# EAGLE design M103 (EAGLE 6.6.0)
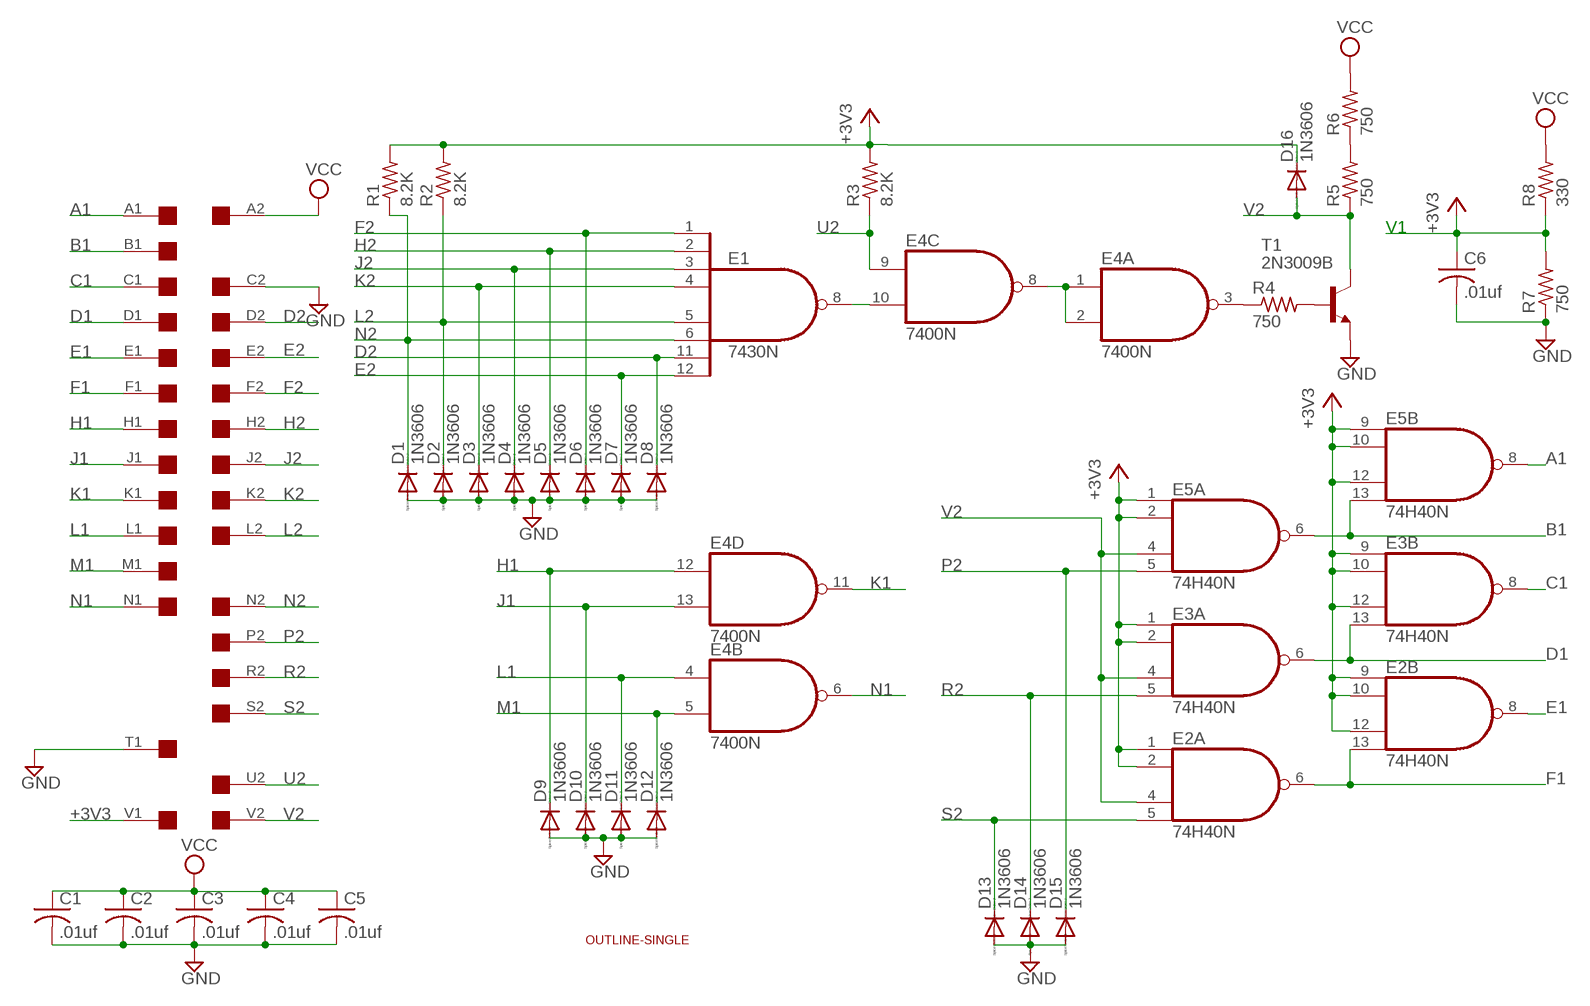
[diagram p0: schematic, sheet 1]

## Parts
C1  .01uf  C-US050-025X075  [C050-025X075]
C2  .01uf  C-US050-025X075  [C050-025X075]
C3  .01uf  C-US050-025X075  [C050-025X075]
C4  .01uf  C-US050-025X075  [C050-025X075]
C5  .01uf  C-US050-025X075  [C050-025X075]
C6  .01uf  C-US050-025X075  [C050-025X075]
D1  1N3606  1N4148DO35-10  [DO35-10]
D2  1N3606  1N4148DO35-10  [DO35-10]
D3  1N3606  1N4148DO35-10  [DO35-10]
D4  1N3606  1N4148DO35-10  [DO35-10]
D5  1N3606  1N4148DO35-10  [DO35-10]
D6  1N3606  1N4148DO35-10  [DO35-10]
D7  1N3606  1N4148DO35-10  [DO35-10]
D8  1N3606  1N4148DO35-10  [DO35-10]
D9  1N3606  1N4148DO35-10  [DO35-10]
D10  1N3606  1N4148DO35-10  [DO35-10]
D11  1N3606  1N4148DO35-10  [DO35-10]
D12  1N3606  1N4148DO35-10  [DO35-10]
D13  1N3606  1N4148DO35-10  [DO35-10]
D14  1N3606  1N4148DO35-10  [DO35-10]
D15  1N3606  1N4148DO35-10  [DO35-10]
D16  1N3606  1N4148DO35-10  [DO35-10]
E1  7430N  [DIL14]
E2  74H40N  74S20N  [DIL14]
E3  74H40N  74S20N  [DIL14]
E4  7400N  [DIL14]
E5  74H40N  74S20N  [DIL14]
R1  8.2K  R-US_0207/10  [0207/10]
R2  8.2K  R-US_0207/10  [0207/10]
R3  8.2K  R-US_0207/10  [0207/10]
R4  750  R-US_0207/10  [0207/10]
R5  750  R-US_0207/10  [0207/10]
R6  750  R-US_0207/10  [0207/10]
R7  750  R-US_0207/10  [0207/10]
R8  330  R-US_0207/10  [0207/10]
T1  2N3009B  2N1613-NPN-TO39-EBC  [TO39]
U$8  SINGLE  [EDGE-CON2]
U$9  OUTLINE-SINGLE  [SINGLE]

## Nets
+3V3: C6.1 D16.C E2.1(A:I0) E2.2(A:I1) E2.9(B:I0) E2.10(B:I1) E2.12(B:I2) E3.1(A:I0) E3.2(A:I1) E3.9(B:I0) E3.10(B:I1) E3.12(B:I2) E5.1(A:I0) E5.2(A:I1) E5.9(B:I0) E5.10(B:I1) E5.12(B:I2) R1.2 R2.2 R3.2 R7.2 R8.1 U$8.V1
A1: E5.8(B:O) U$8.A1
B1: E5.6(A:O) E5.13(B:I3) U$8.B1
C1: E3.8(B:O) U$8.C1
D1: E3.6(A:O) E3.13(B:I3) U$8.D1
D2: D8.C E1.11(I6) U$8.D2
E1: E2.8(B:O) U$8.E1
E2: D7.C E1.12(I7) U$8.E2
F1: E2.6(A:O) E2.13(B:I3) U$8.F1
F2: D6.C E1.1(I0) U$8.F2
GND: C1.2 C2.2 C3.2 C4.2 C5.2 C6.2 D1.A D2.A D3.A D4.A D5.A D6.A D7.A D8.A D9.A D10.A D11.A D12.A D13.A D14.A D15.A R7.1 T1.1(E) U$8.C2 U$8.T1
H1: D9.C E4.12(D:I0) U$8.H1
H2: D5.C E1.2(I1) U$8.H2
J1: D10.C E4.13(D:I1) U$8.J1
J2: D4.C E1.3(I2) U$8.J2
K1: E4.11(D:O) U$8.K1
K2: D3.C E1.4(I3) U$8.K2
L1: D11.C E4.4(B:I0) U$8.L1
L2: D2.C E1.5(I4) R2.1 U$8.L2
M1: D12.C E4.5(B:I1) U$8.M1
N1: E4.6(B:O) U$8.N1
N2: D1.C E1.6(I5) R1.1 U$8.N2
N$2: E4.3(A:O) R4.1
N$3: R4.2 T1.2(B)
N$5: R5.2 R6.1
N$8: E1.8(O) E4.10(C:I1)
N$9: E4.1(A:I0) E4.2(A:I1) E4.8(C:O)
P2: D15.C E5.5(A:I3) U$8.P2
R2: D14.C E3.5(A:I3) U$8.R2
S2: D13.C E2.5(A:I3) U$8.S2
U2: E4.9(C:I0) R3.1 U$8.U2
V2: D16.A E2.4(A:I2) E3.4(A:I2) E5.4(A:I2) R5.1 T1.3(C) U$8.V2
VCC: C1.1 C2.1 C3.1 C4.1 C5.1 R6.2 R8.2 U$8.A2
Unconnected: U$8.B2 U$8.M2 U$8.P1 U$8.R1 U$8.S1 U$8.T2 U$8.U1

## Notes on the sheet
- V1

## Power pins joined to a net without a drawn wire
GND: E1.7(GND) E2.7(P:GND) E3.7(P:GND) E4.7(P:GND) E5.7(P:GND)
VCC: E1.14(VCC) E2.14(P:VCC) E3.14(P:VCC) E4.14(P:VCC) E5.14(P:VCC)

## Library data of the parts
C1-C6 = rcl:C-US: CAPACITOR, American symbol
D1-D16 = diode:1N4148: DIODE high speed (Philips)
E1 = 74xx-us:74*30: 8-input NAND gate
E2 E3 E5 = 74xx-us:74*20: Dual 4-input NAND gate
E4 = 74xx-us:74*00: Quad 2-input NAND gate
R1-R8 = rcl:R-US_: RESISTOR, American symbol
T1 = transistor:*-NPN-: NPN Transistror BF959 corrected 2008.03.06
U$8 = dec-con:SINGLE: Single-Height DEC board
U$9 = dec-con:OUTLINE-*: Board outlines for DEC boards.

## Board
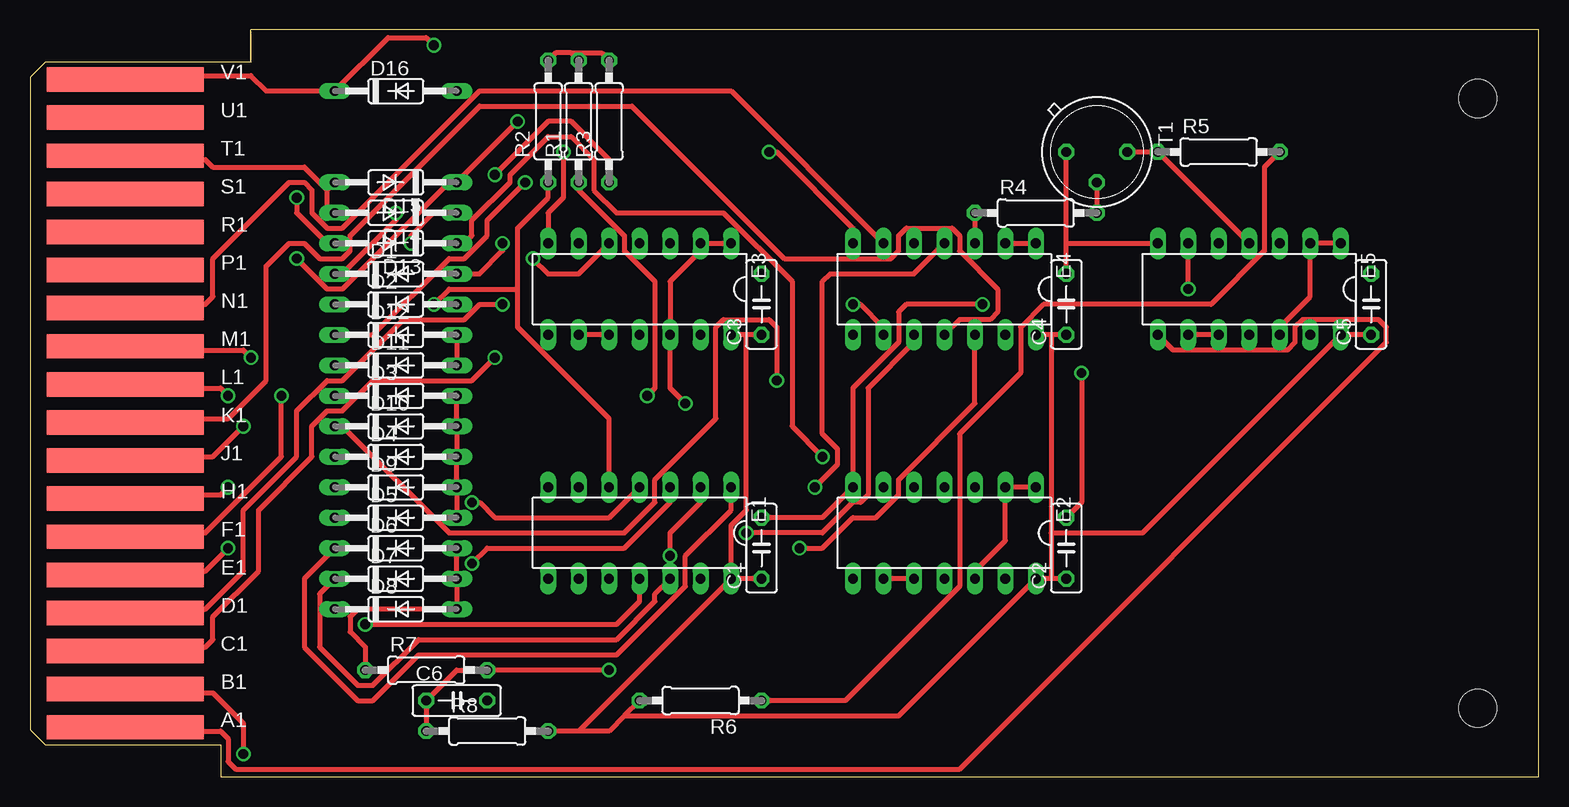
[diagram p1: board, top side]
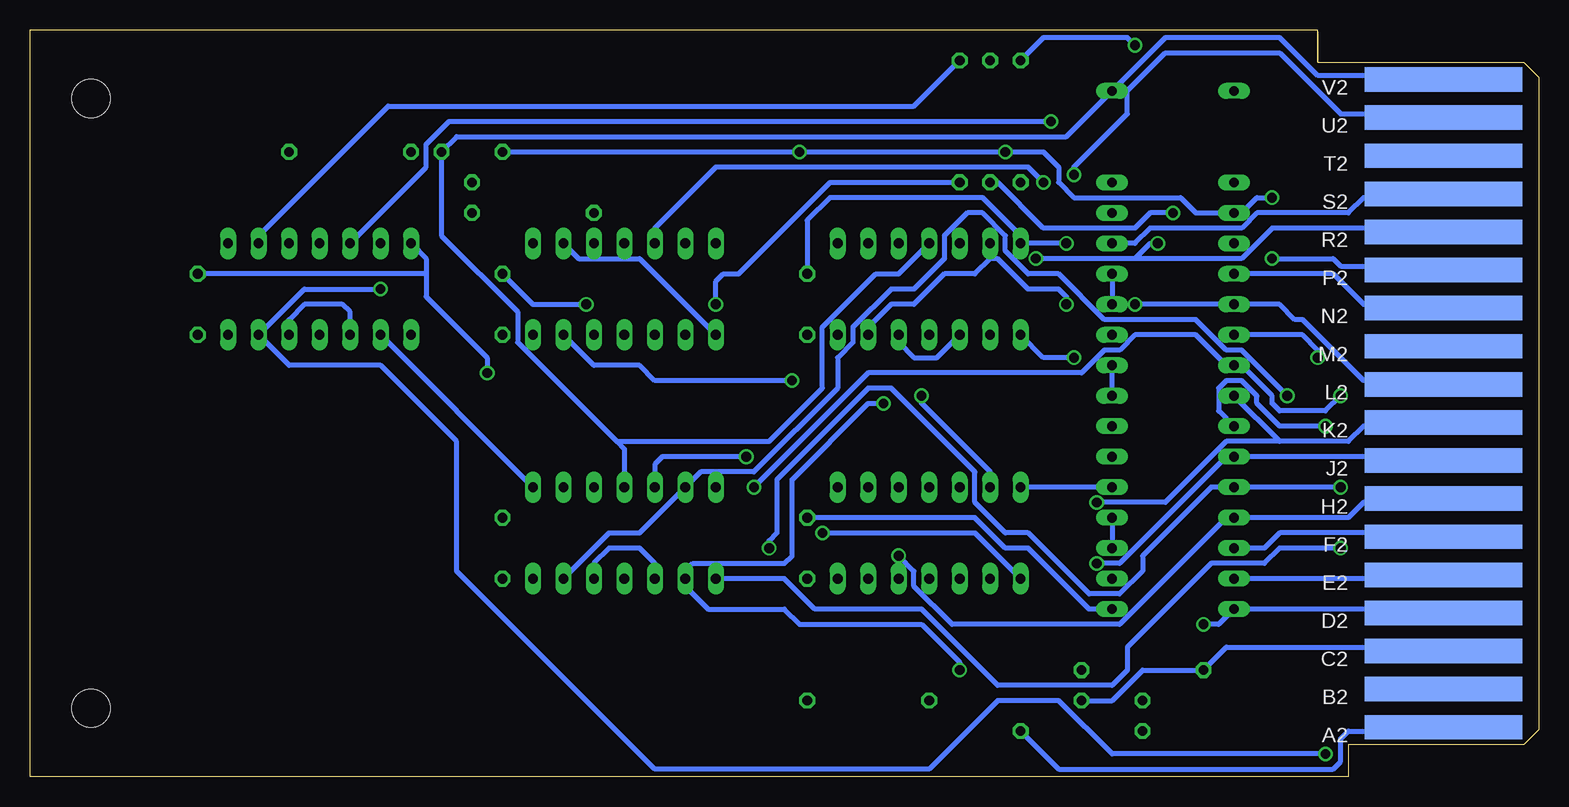
[diagram p2: board, bottom side, seen from below]

Size 125.73 x 62.23 mm. Coordinates in mm from the lower left corner, seen from the top.
Copper layers (1+16): Top 0.035mm / dielectric 1.5mm / Bottom 0.035mm
Design rules "16mils": minimum track width 16mil, minimum drill 32mil, track to track 15mil, track to pad 10mil, pad to pad 10mil, via to via 10mil, smd to smd 10mil, copper to edge 13mil, drill to drill 10mil, minimum pad ring 10mil, minimum via ring 8mil, stop-mask expansion 0mil, vias tented up to drill 0mil, thermal gap 10mil

### Footprints (pad centres in the part's own frame; a part is rotated, then mirrored left to right if it is on the bottom)
C050-025X075 = drill 0.813 octagon: 1 -2.54,0; 2 2.54,0
DO35-10 = drill 0.813 long: A 5.08,0; C -5.08,0
DIL14 = drill 0.813 long: 1 -7.62,-3.81; 2 -5.08,-3.81; 3 -2.54,-3.81; 4 0,-3.81; 5 2.54,-3.81; 6 5.08,-3.81; 7 7.62,-3.81; 8 7.62,3.81; 9 5.08,3.81; 10 2.54,3.81; 11 0,3.81; 12 -2.54,3.81; 13 -5.08,3.81; 14 -7.62,3.81
0207/10 = drill 0.813 octagon: 1 -5.08,0; 2 5.08,0
TO39 = drill 0.813 octagon: 1 0,-2.54; 2 2.54,0; 3 0,2.54
EDGE-CON2 = smd 13.106 x 2.032: A1 7.938,4.128; B1 7.938,7.303; C1 7.938,10.477; D1 7.938,13.652; E1 7.938,16.828; F1 7.938,20.003; H1 7.938,23.177; J1 7.938,26.352; K1 7.938,29.527; L1 7.938,32.703; M1 7.938,35.877; N1 7.938,39.053; P1 7.938,42.227; R1 7.938,45.403; S1 7.938,48.578; T1 7.938,51.752; U1 7.938,54.928; V1 7.938,58.102 | smd 13.106 x 2.032 bottom: A2 7.938,4.128; B2 7.938,7.303; C2 7.938,10.477; D2 7.938,13.652; E2 7.938,16.828; F2 7.938,20.003; H2 7.938,23.177; J2 7.938,26.352; K2 7.938,29.527; L2 7.938,32.703; M2 7.938,35.877; N2 7.938,39.053; P2 7.938,42.227; R2 7.938,45.403; S2 7.938,48.578; T2 7.938,51.752; U2 7.938,54.928; V2 7.938,58.102
SINGLE = hole 3.175: 120.65,56.515; 120.65,5.715

### Placement (x,y rotation side)
C1  60.96,19.05 90 top
C2  86.36,19.05 90 top
C3  60.96,39.37 90 top
C4  86.36,39.37 90 top
C5  111.76,39.37 90 top
C6  35.56,6.35 0 top
D1  30.48,41.91 0 top
D2  30.48,39.37 0 top
D3  30.48,31.75 0 top
D4  30.48,26.67 0 top
D5  30.48,21.59 0 top
D6  30.48,19.05 0 top
D7  30.48,16.51 0 top
D8  30.48,13.97 0 top
D9  30.48,24.13 0 top
D10  30.48,29.21 0 top
D11  30.48,34.29 0 top
D12  30.48,36.83 0 top
D13  30.48,44.45 180 top
D14  30.48,46.99 180 top
D15  30.48,49.53 180 top
D16  30.48,57.15 0 top
E1  50.8,20.32 180 top
E2  76.2,20.32 180 top
E3  50.8,40.64 180 top
E4  76.2,40.64 180 top
E5  101.6,40.64 180 top
R1  45.72,54.61 90 top
R2  43.18,54.61 90 top
R3  48.26,54.61 90 top
R4  83.82,46.99 0 top
R5  99.06,52.07 0 top
R6  55.88,6.35 180 top
R7  33.02,8.89 0 top
R8  38.1,3.81 0 top
T1  88.9,52.07 270 top
U$8  0,0 0 top
U$9  0,0 0 top

### Tracks (layer width: path | path; a pad name or v marks a point on that pad's centre or on a via)
+3V3  (via drill 0.81)
  Top 0.406: R2.2 43.82,60.33 45.09,60.33 | R1.2 45.09,60.33 | R3.2 47.63,60.33 45.09,60.33 | U$8.V1 8.26,58.42 18.42,58.42 19.69,57.15 D16.C 29.85,61.59 33.02,61.59 v33.66,60.96 | E3.10 E3.9 | E3.1 E3.2 55.88,43.81 53.34,41.27 E3.12 53.34,32.38 v54.61,31.11 | E5.1 E5.2 106.68,40.01 104.14,37.47 E5.12 | E5.10 E5.9 | R8.1 C6.1 35.56,8.89 R7.2 v48.26,8.89 | E2.1 E2.2 81.28,19.68 78.74,17.14 E2.12 | E2.10 E2.9
  Bottom 0.406: R2.2 41.28,61.59 34.29,61.59 v33.66,60.96 | E3.10 50.17,34.92 52.07,34.92 53.34,36.2 E3.12 | E5.12 104.14,38.1 102.87,39.37 99.7,39.37 99.06,38.73 E5.10 | E2.12 78.74,17.78 77.47,19.05 74.93,19.05 73.66,17.78 E2.10 | v48.26,8.89 48.26,9.53 51.44,12.7 61.6,12.7 62.87,13.97 69.22,13.97 71.12,15.88 E2.9 71.12,17.14 70.49,17.78 62.87,17.78 62.23,18.41 62.23,24.77 55.88,31.11 v54.61,31.11 | E2.1 E5.9 | R3.2 52.07,55.88 95.89,55.88 106.68,45.09 E5.2
A1
  Top 0.406: E5.8 95.25,35.56 104.78,35.56 105.41,36.2 105.41,37.47 106.05,38.1 112.4,38.1 113.03,37.47 113.03,36.2 77.47,0.64 17.15,0.64 16.51,1.27 16.51,3.17 15.88,3.81 8.26,3.81 U$8.A1
B1  (via drill 0.81)
  Top 0.406: v96.52,40.64 E5.6 | v17.78,1.91 17.78,4.45 15.24,6.99 12.07,6.99 11.43,7.62 8.26,7.62 U$8.B1
  Bottom 0.406: v96.52,40.64 102.87,40.64 E5.13 104.14,34.29 96.52,34.29 90.17,27.94 90.17,17.14 73.66,0.64 50.8,0.64 45.09,6.35 40.01,6.35 35.56,1.91 v17.78,1.91
C1  (via drill 0.81)
  Top 0.406: v38.74,34.92 36.83,33.02 28.58,33.02 26.04,30.48 24.77,30.48 23.5,29.21 23.5,26.67 19.05,22.23 19.05,17.14 15.24,13.34 15.24,11.43 14.61,10.79 8.26,10.79 U$8.C1
  Bottom 0.406: E3.8 41.28,34.92 v38.74,34.92
D1  (via drill 0.81)
  Top 0.406: v39.37,39.37 37.47,39.37 36.2,38.1 31.12,38.1 26.04,33.02 24.77,33.02 22.23,30.48 22.23,26.67 17.78,22.23 17.78,17.14 14.61,13.97 8.26,13.97 U$8.D1
  Bottom 0.406: E3.13 55.88,37.47 53.98,39.37 52.07,39.37 49.53,41.91 46.99,41.91 45.72,43.18 | E3.6 45.72,43.18 | 45.72,43.18 45.09,43.18 42.55,40.64 40.01,40.64 39.37,40.01 v39.37,39.37
D2  (via drill 0.81)
  Top 0.406: E1.11 50.8,14.61 48.9,12.7 v27.94,12.7
  Bottom 0.406: U$8.D2 8.26,13.97 D8.C 26.67,12.7 v27.94,12.7
E1  (via drill 0.81)
  Top 0.406: v16.51,19.05 14.61,17.14 8.26,17.14 U$8.E1
  Bottom 0.406: E2.8 62.87,16.51 60.33,13.97 51.44,13.97 45.09,7.62 35.56,7.62 34.29,8.89 34.29,10.79 27.31,17.78 22.86,17.78 21.59,19.05 v16.51,19.05
E2
  Top 0.406: E1.12 52.07,15.24 52.07,14.61 48.9,11.43 32.39,11.43 28.58,7.62 27.31,7.62 24.13,10.79 24.13,15.24 D7.C
  Bottom 0.406: D7.C 8.26,16.51 U$8.E2
F1  (via drill 0.81)
  Top 0.406: v20.96,31.75 20.96,26.67 14.61,20.32 8.26,20.32 U$8.F1
  Bottom 0.406: E2.13 77.47,20.32 74.93,20.32 E2.6 69.85,25.4 65.41,25.4 58.42,32.38 58.42,34.92 57.15,36.2 57.15,37.47 53.98,40.64 52.07,40.64 49.53,43.18 49.53,45.09 47.63,46.99 46.36,46.99 44.45,45.09 44.45,43.81 42.55,41.91 40.01,41.91 36.2,38.1 28.58,38.1 26.04,35.56 24.77,35.56 v20.96,31.75
F2
  Top 0.406: E1.1 58.42,22.23 54.61,18.41 54.61,15.88 48.9,10.16 32.39,10.16 28.58,6.35 27.31,6.35 22.86,10.79 22.86,16.51 D6.C
  Bottom 0.406: D6.C 22.86,19.05 21.59,20.32 8.26,20.32 U$8.F2
GND  (via drill 0.81)
  Top 0.406: C1.2 66.04,21.59 E2.7 68.58,32.38 72.39,36.2 72.39,38.73 73.03,39.37 v79.38,39.37 | D12.A D11.A | D3.A D10.A D4.A D9.A D5.A | D6.A D7.A D8.A 27.31,13.97 26.67,13.34 26.67,12.06 27.94,10.79 R7.1 | C2.2 87.63,22.86 v87.63,33.66 | D13.A 24.77,44.45 22.23,46.99 v22.23,48.26 | 24.77,48.9 D15.A | 24.77,48.9 24.77,46.99 D14.A | 24.77,48.9 22.86,50.8 15.24,50.8 14.61,51.44 12.07,51.44 11.43,52.07 8.26,52.07 U$8.T1 | v39.37,44.45 39.37,43.81 37.47,41.91 D1.A | C4.2 86.36,44.45 | 86.36,44.45 T1.1 | E4.7 68.58,45.72 62.23,52.07 v61.6,52.07 | E3.7 43.18,46.99 44.45,48.26 v44.45,52.07 | 86.36,44.45 E5.7
  Bottom 0.406: C6.2 35.56,6.35 33.02,8.89 R7.1 26.04,10.79 8.26,10.79 U$8.C2 | D3.A D11.A | D9.A E1.7 | D5.A D6.A | C1.2 46.99,21.59 44.45,19.05 42.55,19.05 37.47,13.97 D8.A | v87.63,33.66 87.63,34.92 92.71,40.01 92.71,41.91 | 92.71,41.91 92.71,43.18 E5.7 | 92.71,41.91 C5.2 | v22.23,48.26 23.5,48.26 24.77,46.99 D14.A 28.58,46.99 29.85,48.26 38.74,48.26 40.01,49.53 40.01,50.8 41.28,52.07 v44.45,52.07 v61.6,52.07 T1.1 | D1.A D2.A | v39.37,44.45 42.55,44.45 | C3.2 60.96,46.35 59.06,48.26 46.36,48.26 42.55,44.45 | 42.55,44.45 E3.7 | v79.38,39.37 83.82,39.37 C4.2
H1  (via drill 0.81)
  Top 0.406: v16.51,24.13 15.88,23.5 8.26,23.5 U$8.H1 | E4.12 78.74,31.11 72.39,24.77 72.39,23.5 70.49,21.59 68.58,21.59 66.04,19.05 v64.14,19.05
  Bottom 0.406: v16.51,24.13 D9.C 27.31,24.13 33.02,18.41 33.02,17.14 34.93,15.24 37.47,15.24 42.55,20.32 44.45,20.32 46.99,22.86 46.99,25.4 53.98,32.38 55.88,32.38 63.5,24.77 63.5,20.32 64.14,19.68 v64.14,19.05
H2  (via drill 0.81)
  Top 0.406: E1.2 55.88,22.86 53.34,20.32 v53.34,18.41
  Bottom 0.406: U$8.H2 8.26,23.5 11.43,23.5 12.07,22.86 14.61,22.86 15.88,21.59 D5.C 26.04,21.59 34.93,12.7 48.9,12.7 52.07,15.88 52.07,17.14 v53.34,18.41
J1  (via drill 0.81)
  Top 0.406: v17.78,29.21 15.24,26.67 8.26,26.67 U$8.J1 | v62.23,33.02 62.23,37.47 61.6,38.1 57.79,38.1 57.15,37.47 57.15,29.84 52.07,24.77 52.07,22.86 49.53,20.32 34.93,20.32 26.04,29.21 D10.C
  Bottom 0.406: D10.C 26.67,30.48 26.67,32.38 26.04,33.02 24.77,33.02 23.5,31.75 23.5,31.11 21.59,29.21 v17.78,29.21 | E4.13 78.74,34.29 74.93,34.29 73.66,33.02 v62.23,33.02
J2  (via drill 0.81)
  Top 0.406: E1.3 53.34,22.86 49.53,19.05 38.1,19.05 v36.83,17.78
  Bottom 0.406: U$8.J2 8.26,26.67 D4.C 26.04,26.67 34.93,17.78 v36.83,17.78
K1
  Top 0.406: E4.11 77.47,38.1 80.01,38.1 80.65,38.73 80.65,40.64 77.47,43.81 77.47,45.09 76.84,45.72 73.03,45.72 72.39,45.09 72.39,43.81 71.76,43.18 62.87,43.18 50.17,55.88 37.47,55.88 26.67,45.09 26.67,43.81 26.04,43.18 24.13,43.18 22.86,44.45 21.59,44.45 19.69,42.55 19.69,33.02 16.51,29.84 8.26,29.84 U$8.K1
K2  (via drill 0.81)
  Top 0.406: E1.4 48.26,21.59 38.74,21.59 37.47,22.86 v36.83,22.86
  Bottom 0.406: 21.59,27.94 D3.C | 21.59,27.94 15.88,27.94 14.61,29.21 12.07,29.21 11.43,29.84 8.26,29.84 U$8.K2 | v36.83,22.86 31.12,22.86 26.04,27.94 21.59,27.94
L1  (via drill 0.81)
  Top 0.406: v16.51,31.75 15.88,32.38 12.07,32.38 11.43,33.02 8.26,33.02 U$8.L1 | E4.4 73.66,41.91 66.68,41.91 66.04,41.27 66.04,28.57 67.31,27.3 67.31,26.04 v65.41,24.13
  Bottom 0.406: v16.51,31.75 17.78,30.48 21.59,30.48 22.23,31.11 22.23,31.75 24.77,34.29 D11.C 26.04,34.29 28.58,36.83 33.66,36.83 34.93,35.56 36.2,35.56 38.1,33.66 55.88,33.66 v65.41,24.13
L2  (via drill 0.81)
  Top 0.406: R2.1 43.18,48.26 40.64,45.72 40.64,40.64 | 40.64,40.64 40.64,37.47 48.26,29.84 E1.5 | 40.64,40.64 34.93,40.64 v33.66,39.37
  Bottom 0.406: U$8.L2 8.26,33.02 14.61,33.02 19.69,38.1 20.32,38.1 21.59,39.37 D2.C v33.66,39.37
M1  (via drill 0.81)
  Top 0.406: v18.42,34.92 17.78,35.56 12.07,35.56 11.43,36.2 8.26,36.2 U$8.M1 | v41.28,49.53 38.1,46.35 38.1,45.09 36.2,43.18 34.93,43.18 28.58,36.83 D12.C
  Bottom 0.406: D12.C 19.69,36.83 18.42,35.56 v18.42,34.92 | E4.5 73.66,45.72 68.58,50.8 42.55,50.8 v41.28,49.53
N1
  Top 0.406: E4.6 58.42,57.15 37.47,57.15 26.04,45.72 24.77,45.72 23.5,46.99 23.5,48.9 22.86,49.53 21.59,49.53 15.24,43.18 15.24,40.01 14.61,39.37 8.26,39.37 U$8.N1
N2  (via drill 0.81)
  Top 0.406: v51.44,31.75 52.07,32.38 52.07,41.27 49.53,43.81 49.53,45.09 45.72,48.9 R1.1 | v30.48,46.99 30.48,46.35 26.04,41.91 D1.C
  Bottom 0.406: E1.6 45.72,25.4 51.44,31.11 v51.44,31.75 | D1.C 17.15,41.91 14.61,39.37 8.26,39.37 U$8.N2 | R1.1 45.09,49.53 41.28,45.72 33.66,45.72 32.39,46.99 v30.48,46.99
N$2
  Top 0.406: R4.1 E4.3
N$3
  Top 0.406: T1.2 R4.2
N$5
  Top 0.406: R6.1 67.95,6.35 77.47,15.88 77.47,28.57 82.55,33.66 82.55,37.47 84.46,39.37 98.43,39.37 102.87,43.81 102.87,50.8 R5.2
N$8  (via drill 0.81)
  Top 0.406: v59.69,20.32 66.04,20.32 68.58,22.86 69.22,22.86 69.85,23.5 69.85,32.38 73.66,36.2 E4.10
  Bottom 0.406: E1.8 46.99,20.32 v59.69,20.32
N$9
  Top 0.406: E4.2 E4.1
  Bottom 0.406: E4.8 74.93,43.18 80.01,43.18 E4.2
P2  (via drill 0.81)
  Top 0.406: v40.64,54.61 D15.C 34.93,49.53 26.04,40.64 24.77,40.64 v22.23,43.18
  Bottom 0.406: v40.64,54.61 90.81,54.61 92.71,52.7 92.71,50.8 E5.5 | v22.23,43.18 17.15,43.18 16.51,42.55 8.26,42.55 U$8.P2
R2  (via drill 0.81)
  Top 0.406: E3.5 45.72,41.91 43.18,41.91 v41.91,43.18 | D14.C 33.66,46.99 31.75,45.09 v31.75,44.45
  Bottom 0.406: 33.66,43.18 24.77,43.18 22.23,45.72 8.26,45.72 U$8.R2 | 33.66,43.18 v41.91,43.18 | v31.75,44.45 32.39,44.45 33.66,43.18
S2  (via drill 0.81)
  Top 0.406: v66.04,26.67 63.5,29.21 63.5,41.27 57.79,46.99 48.9,46.99 46.99,48.9 46.99,51.44 45.09,53.34 43.18,53.34 40.01,50.16 40.01,49.53 36.83,46.35 36.83,45.09 36.2,44.45 D13.C
  Bottom 0.406: D13.C 33.66,44.45 32.39,45.72 24.77,45.72 23.5,46.99 15.88,46.99 14.61,48.26 12.07,48.26 11.43,48.9 8.26,48.9 U$8.S2 | E2.5 73.66,26.04 73.03,26.67 v66.04,26.67
U2  (via drill 0.81)
  Top 0.406: v68.58,39.37 69.22,39.37 71.12,37.47 E4.9 | v38.74,50.16 43.18,54.61 45.09,54.61 48.26,51.44 R3.1
  Bottom 0.406: R3.1 59.06,49.53 66.68,41.91 67.95,41.91 68.58,41.27 v68.58,39.37 | v38.74,50.16 38.74,50.8 34.29,55.24 34.29,57.15 31.12,60.33 21.59,60.33 16.51,55.24 8.26,55.24 U$8.U2
V2
  Top 0.406: T1.3 R5.1 E5.4
  Bottom 0.406: U$8.V2 8.26,58.42 18.42,58.42 21.59,61.59 31.12,61.59 D16.A 39.37,53.34 90.17,53.34 T1.3 91.44,45.09 85.09,38.73 85.09,36.2 76.84,27.94 | E2.4 76.2,27.3 76.84,27.94 | E3.4 53.34,41.91 55.25,41.91 59.69,37.47 59.69,32.38 64.14,27.94 76.84,27.94
VCC
  Top 0.406: C5.1 E5.14 92.71,20.32 85.09,20.32 | C2.1 85.09,16.51 | 85.09,16.51 E2.14 72.39,5.08 49.53,5.08 | C4.1 85.09,36.83 | 85.09,36.83 E4.14 | 85.09,36.83 85.09,20.32 | 85.09,20.32 85.09,16.51 | C3.1 59.69,36.83 | 59.69,36.83 E3.14 | C1.1 E1.14 | 45.72,3.81 48.26,3.81 49.53,5.08 | 45.72,3.81 R8.2 | R6.2 49.53,5.08 | 45.72,3.81 E1.14 | 59.69,36.83 59.69,22.23 58.42,20.95 E1.14
  Bottom 0.406: R8.2 40.01,0.64 17.15,0.64 16.51,1.27 16.51,3.17 15.88,3.81 8.26,3.81 U$8.A2